# Altium project PanelDriver.PrjPcb
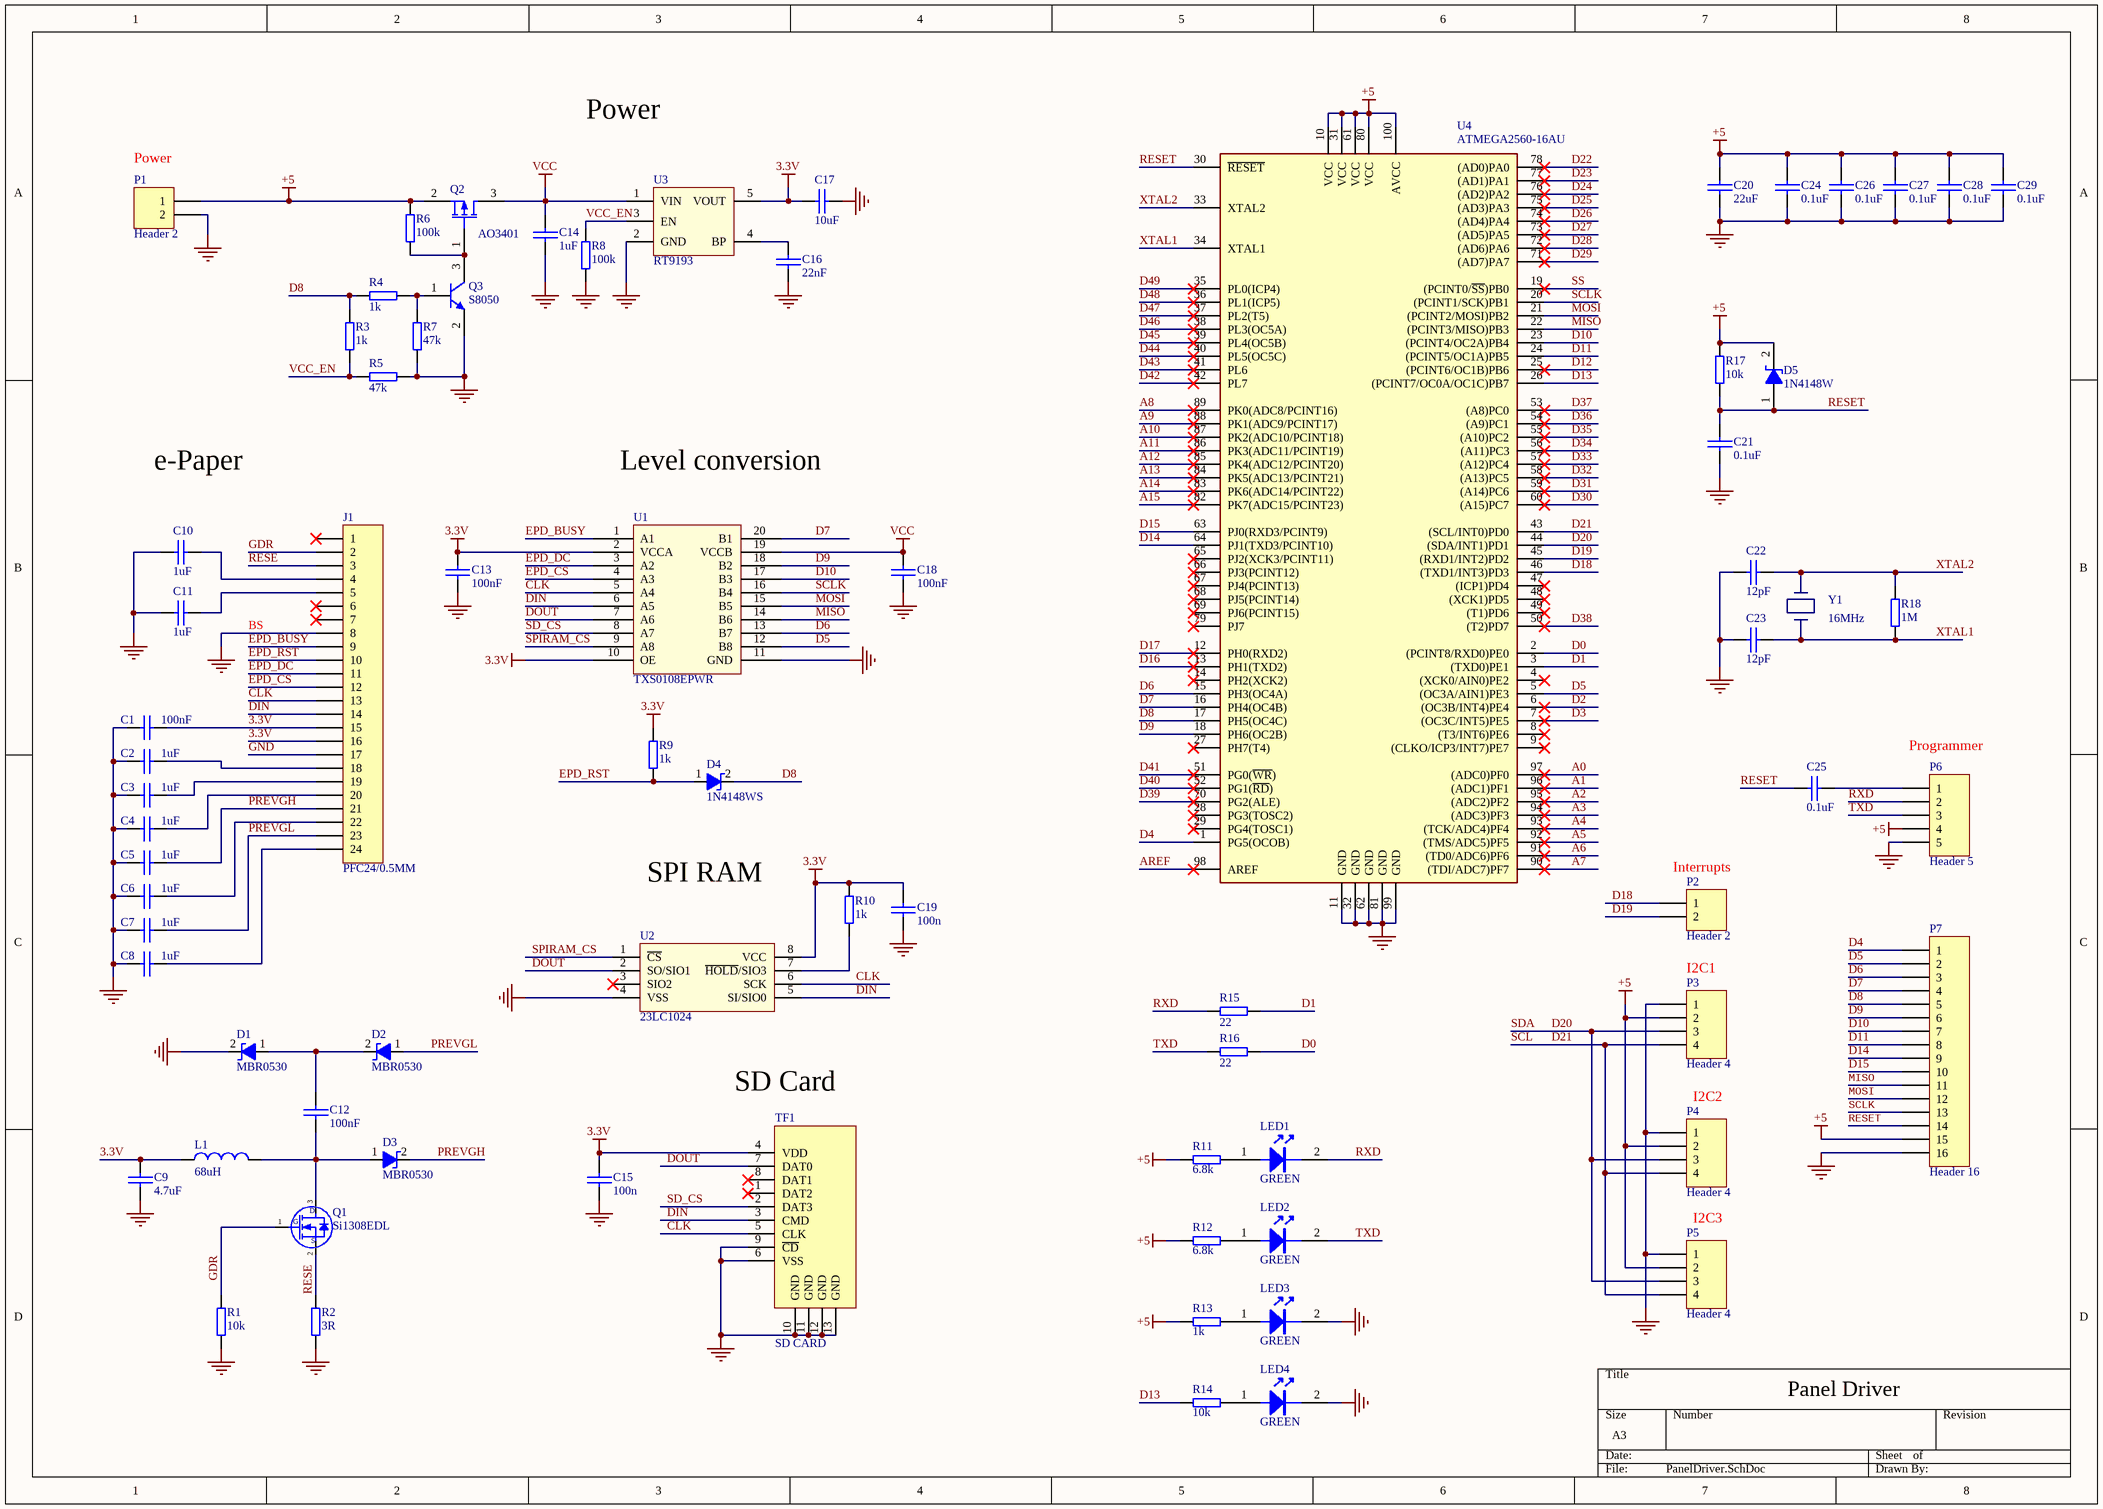
[diagram p0: PanelDriver.SchDoc]
1 sheet, 74 parts. Net scope: global (net labels, ports and power ports of the same name join across sheets).
Board file: PanelDriver.PcbDoc

## Sheet PanelDriver.SchDoc
size A3

### Parts
C1  100nF  [C0603]
C2  1uF  [C0603]
C3  1uF  [C0603]
C4  1uF  [C0603]
C5  1uF  [C0603]
C6  1uF  [C0603]
C7  1uF  [C0603]
C8  1uF  [C0603]
C9  4.7uF  [C0603]
C10  1uF  [C0603]
C11  1uF  [C0603]
C12  100nF  [C0603]
C13  100nF  [C0603]
C14  1uF  [C0603]
C15  100n  [C0603]
C16  22nF  [C0603]
C17  10uF  [C0603]
C18  100nF  [C0603]
C19  100n  [C0603]
C20  22uF  [C1206]
C21  0.1uF  [C0603]
C22  12pF  [C0603]
C23  12pF  [C0603]
C24  0.1uF  [C0603]
C25  0.1uF  [C0603]
C26  0.1uF  [C0603]
C27  0.1uF  [C0603]
C28  0.1uF  [C0603]
C29  0.1uF  [C0603]
D1  MBR0530  [SOD123]
D2  MBR0530  [SOD123]
D3  MBR0530  [SOD123]
D4  1N4148WS  [SOD-323]
D5  1N4148W  [SOD123]
J1  PFC24/0.5MM  [PFC24/0.5MM]
L1  68uH  [CD43]
LED1  GREEN  [LED-0603-GREEN]
LED2  GREEN  [LED-0603-GREEN]
LED3  GREEN  [LED-0603-GREEN]
LED4  GREEN  [LED-0603-GREEN]
P1  Header 2  [HDR1X2]
P2  Header 2  [HDR1X2]
P3  Header 4  [HDR1X4]
P4  Header 4  [HDR1X4]
P5  Header 4  [HDR1X4]
P6  Header 5  [HDR1X5]
P7  Header 16  [HDR1X16]
Q1  Si1308EDL  [SOT323-3]
Q2  AO3401  [SOT-23]
Q3  S8050  [SOT-23]
R1  10k  [R0603]
R2  3R  [R0603]
R3  1k  [R0603]
R4  1k  [R0603]
R5  47k  [R0603]
R6  100k  [R0603]
R7  47k  [R0603]
R8  100k  [R0603]
R9  1k  [R0603]
R10  1k  [R0603]
R11  6.8k  [R0603]
R12  6.8k  [R0603]
R13  1k  [R0603]
R14  10k  [R0603]
R15  22  [R0603]
R16  22  [R0603]
R17  10k  [R0603]
R18  1M  [R0603]
TF1  SD CARD  [L-KLS1-TF-003-uSD]
U1  TXS0108EPWR  [TSSOP-20_0.65mm]
U2  23LC1024  [SO8]
U3  RT9193  [SOT23-5]
U4  ATMEGA2560-16AU  [TQFP100A]
Y1  16MHz  [HC-49/US-SMD]

### Nets
3.3V: C1.1 C9.1 C13.1 C15.2 C17.2 C19.2 J1.15 J1.16 L1.1 R9.2 R10.1 TF1.4(VDD) U1.2(VCCA) U1.10(OE) U2.8(VCC) U3.5(VOUT)
+5: C20.2 C24.2 C26.2 C27.2 C28.2 C29.1 D5.2(K) P1.1 P3.2 P4.2 P5.2 P6.4 P7.15 Q2.2(S) R6.1 R11.1 R12.1 R13.1 R17.2 U4.10(VCC) U4.31(VCC) U4.61(VCC) U4.80(VCC) U4.100(AVCC)
GND: C1.2 C2.2 C3.2 C4.2 C5.2 C6.2 C7.2 C8.2 C9.2 C10.2 C11.2 C13.2 C14.1 C15.1 C16.1 C17.1 C18.2 C19.1 C20.1 C21.1 C22.2 C23.2 C24.1 C26.1 C27.1 C28.1 C29.2 D1.2(K) J1.8 J1.17 LED3.2(K) LED4.2(K) P1.2 P3.1 P4.1 P5.1 P6.5 P7.16 Q3.2(E) R1.2 R2.2 R5.1 R7.1 R8.2 TF1.6(VSS) TF1.9(~{CD}) TF1.10(GND) TF1.11(GND) TF1.12(GND) TF1.13(GND) U1.11(GND) U2.4(VSS) U3.2(GND) U4.11(GND) U4.32(GND) U4.62(GND) U4.81(GND) U4.99(GND)
VCC: C14.2 C18.1 Q2.3(D) U1.19(VCCB) U3.1(VIN)
A0: U4.97((ADC0)PF0)
A1: U4.96((ADC1)PF1)
A2: U4.95((ADC2)PF2)
A3: U4.94((ADC3)PF3)
A4: U4.93((TCK/ADC4)PF4)
A5: U4.92((TMS/ADC5)PF5)
A6: U4.91((TD0/ADC6)PF6)
A7: U4.90((TDI/ADC7)PF7)
A8: U4.89(PK0(ADC8/PCINT16))
A9: U4.88(PK1(ADC9/PCINT17))
A10: U4.87(PK2(ADC10/PCINT18))
A11: U4.86(PK3(ADC11/PCINT19))
A12: U4.85(PK4(ADC12/PCINT20))
A13: U4.84(PK5(ADC13/PCINT21))
A14: U4.83(PK6(ADC14/PCINT22))
A15: U4.82(PK7(ADC15/PCINT23))
AREF: U4.98(AREF)
CLK: J1.13 TF1.5(CLK) U1.5(A4) U2.6(SCK)
D0: R16.1 U4.2((PCINT8/RXD0)PE0)
D1: R15.1 U4.3((TXD0)PE1)
D2: U4.6((OC3B/INT4)PE4)
D3: U4.7((OC3C/INT5)PE5)
D4: P7.1 U4.1(PG5(OCOB))
D5: P7.2 U1.12(B8) U4.5((OC3A/AIN1)PE3)
D6: P7.3 U1.13(B7) U4.15(PH3(OC4A))
D7: P7.4 U1.20(B1) U4.16(PH4(OC4B))
D8: D4.2(K) P7.5 R3.2 R4.1 U4.17(PH5(OC4C))
D9: P7.6 U1.18(B2) U4.18(PH6(OC2B))
D10: P7.7 U1.17(B3) U4.23((PCINT4/OC2A)PB4)
D11: P7.8 U4.24((PCINT5/OC1A)PB5)
D12: U4.25((PCINT6/OC1B)PB6)
D13: R14.1 U4.26((PCINT7/OC0A/OC1C)PB7)
D14: P7.9 U4.64(PJ1(TXD3/PCINT10))
D15: P7.10 U4.63(PJ0(RXD3/PCINT9))
D16: U4.13(PH1(TXD2))
D17: U4.12(PH0(RXD2))
D18: P2.1 U4.46((TXD1/INT3)PD3)
D19: P2.2 U4.45((RXD1/INT2)PD2)
D20: P3.3 P4.3 P5.3 U4.44((SDA/INT1)PD1)  [also labelled SDA]
D21: P3.4 P4.4 P5.4 U4.43((SCL/INT0)PD0)  [also labelled SCL]
D22: U4.78((AD0)PA0)
D23: U4.77((AD1)PA1)
D24: U4.76((AD2)PA2)
D25: U4.75((AD3)PA3)
D26: U4.74((AD4)PA4)
D27: U4.73((AD5)PA5)
D28: U4.72((AD6)PA6)
D29: U4.71((AD7)PA7)
D30: U4.60((A15)PC7)
D31: U4.59((A14)PC6)
D32: U4.58((A13)PC5)
D33: U4.57((A12)PC4)
D34: U4.56((A11)PC3)
D35: U4.55((A10)PC2)
D36: U4.54((A9)PC1)
D37: U4.53((A8)PC0)
D38: U4.50((T2)PD7)
D39: U4.70(PG2(ALE))
D40: U4.52(PG1(~{RD}))
D41: U4.51(PG0(~{WR}))
D42: U4.42(PL7)
D43: U4.41(PL6)
D44: U4.40(PL5(OC5C))
D45: U4.39(PL4(OC5B))
D46: U4.38(PL3(OC5A))
D47: U4.37(PL2(T5))
D48: U4.36(PL1(ICP5))
D49: U4.35(PL0(ICP4))
DIN: J1.14 TF1.3(CMD) U1.6(A5) U2.5(SI/SIO0)
DOUT: TF1.7(DAT0) U1.7(A6) U2.2(SO/SIO1)
EPD_BUSY: J1.9 U1.1(A1)
EPD_CS: J1.12 U1.4(A3)
EPD_DC: J1.11 U1.3(A2)
EPD_RST: D4.1(A) J1.10 R9.1
GDR: J1.2 Q1.1(G) R1.1
MISO: P7.11 U1.14(B6) U4.22((PCINT3/MISO)PB3)
MOSI: P7.12 U1.15(B5) U4.21((PCINT2/MOSI)PB2)
PREVGH: C5.1 D3.2(K) J1.21
PREVGL: C7.1 D2.1(A) J1.23
RESE: J1.3 Q1.2(S) R2.1
RESET: C21.2 C25.2 D5.1(A) P7.14 R17.1 U4.30(~{RESET})
RXD: LED1.2(K) P6.2 R15.2
SCLK: P7.13 U1.16(B4) U4.20((PCINT1/SCK)PB1)
SD_CS: TF1.2(DAT3) U1.8(A7)
SPIRAM_CS: U1.9(A8) U2.1(~{CS})
SS: U4.19((PCINT0/~{SS})PB0)
TXD: LED2.2(K) P6.3 R16.2
VCC_EN: R3.1 R5.2 R8.1 U3.3(EN)
XTAL1: C23.1 R18.2 U4.34(XTAL1) Y1.2
XTAL2: C22.1 R18.1 U4.33(XTAL2) Y1.1
NetC2_1: C2.1 J1.18
NetC3_1: C3.1 J1.19
NetC4_1: C4.1 J1.20
NetC6_1: C6.1 J1.22
NetC8_1: C8.1 J1.24
NetC10_1: C10.1 J1.4
NetC11_1: C11.1 J1.5
NetC12_1: C12.1 D1.1(A) D2.2(K)
NetC12_2: C12.2 D3.1(A) L1.2 Q1.3(D)
NetC16_2: C16.2 U3.4(BP)
NetC25_1: C25.1 P6.1
NetLED1_1: LED1.1(A) R11.2
NetLED2_1: LED2.1(A) R12.2
NetLED3_1: LED3.1(A) R13.2
NetLED4_1: LED4.1(A) R14.2
NetQ2_1: Q2.1(G) Q3.3(C) R6.2
NetQ3_1: Q3.1(B) R4.2 R7.2
NetR10_2: R10.2 U2.7(~{HOLD}/SIO3)

Not connected (* = marked no-connect by the designer): J1 1* 6* 7*; TF1 1(DAT2)* 8(DAT1)*; U2 3(SIO2)*; U4 4((XCK0/AIN0)PE2)* 8((T3/INT6)PE6)* 9((CLKO/ICP3/INT7)PE7)* 14(PH2(XCK2))* 27(PH7(T4))* 28(PG3(TOSC2))* 29(PG4(TOSC1))* 47((ICP1)PD4)* 48((XCK1)PD5)* 49((T1)PD6)* 65(PJ2(XCK3/PCINT11))* 66(PJ3(PCINT12))* 67(PJ4(PCINT13))* 68(PJ5(PCINT14))* 69(PJ6(PCINT15))* 79(PJ7)*

### Notes on the sheet
- (near P1) Power
- Power
- e-Paper
- Level conversion
- BS
- (near P6) Programmer
- SPI RAM
- (near P2) Interrupts
- I2C1
- SD Card
- I2C2
- I2C3
- Panel Driver

### Library data of the parts
C1-C15 C18 C19 = C: Capacitor; Manufacturer: Any; Manufacturer Part Number: Any
C16 C17 = C_100uF_6.3V_1206: Capacitor; Manufacturer: Any; Voltage: 6.3V; Parameter 1: 85; Manufacturer Part Number: Any; Chip-Dip Link: https://www.chipdip.ru/product0/8015829745
C20 = C: 16V 22uF X7R ±10% 1206  Multilayer Ceramic Capacitors MLCC - SMD/SMT ROHS; Manufacturer: Any; Manufacturer Part Number: Any
C21 C24-C29 = C: 25V 100nF X7R ±10% 0603  Multilayer Ceramic Capacitors MLCC - SMD/SMT ROHS; Manufacturer: Any; Manufacturer Part Number: Any
  C28: JLCPCB Part Number: C307361; JLCPCB Price: 0.02
C22 C23 = C_100uF_6.3V_1206: 50V 22pF X7R ±10% 0603  Multilayer Ceramic Capacitors MLCC - SMD/SMT ROHS; Manufacturer: Any; Voltage: 6.3V; Parameter 1: 85; Manufacturer Part Number: Any; Chip-Dip Link: https://www.chipdip.ru/product0/8015829745
D1-D4 = SS14F: Manufacture: UMF; Manufacturer: Any; Chip-Dip Link: https://www.chipdip.ru/product/ss14f; Price: 4
  D1-D3: Manufacturer Part Number: MBR0530
  D4: Manufacturer Part Number: 1N4148WS
D5 = SS14F: 1N4148W-E3-08, Rectifier Diode Small Signal Switching Si 100V 0.15A 4ns 2-Pin SOD-123 T/R; Manufacture: Any; Price: 4; Manufacturer: Any; Manufacturer Part Number: Any
J1 = PFC24/0.5MMHeader 24: 24 Position FFC, FPC Connector Contacts, Bottom 0.020" (0.50mm) Surface Mount, Right Angle; Manufacturer: MOLEX; Manufacturer Part Number: 0524372471; LatestRevisionDate: 17-Jul-2002; LatestRevisionNote: Re-released for DXP Platform.; Publisher: Altium Limited
L1 = IND: SMD, 4x4mm  Inductor; Manufacturer: Any; Manufacturer Part Number: Any; Chip-Dip Link: https://www.chipdip.ru/product/lqh55dn470m; Price: 110
LED1-LED4 = LED: 0603  Light Emitting Diodes (LED) ROHS; Manufacturer: Any; Manufacturer Part Number: Any; JLCPCB Part Number: C965812; JLCPCB Price: 0.005
P1 P2 = Header 2: Header, 2-Pin; LatestRevisionDate: 17-Jul-2002; LatestRevisionNote: Re-released for DXP Platform.; Publisher: Altium Limited
P3-P5 = Header 4: Header, 4-Pin; LatestRevisionDate: 17-Jul-2002; LatestRevisionNote: Re-released for DXP Platform.; Publisher: Altium Limited
P6 = Header 5: Header, 5-Pin; Manufacturer: Any; LatestRevisionDate: 17-Jul-2002; LatestRevisionNote: Re-released for DXP Platform.; Publisher: Altium Limited; Manufacturer Part Number: Any
P7 = Header 16: Header, 16-Pin; LatestRevisionDate: 17-Jul-2002; LatestRevisionNote: Re-released for DXP Platform.; Publisher: Altium Limited
Q1 = Si1308EDL: Manufacturer: Any; PartNumber: Si1308EDL; Manufacturer Part Number: Si1308EDL
Q2 = ZXMP6A13FTA: Manufacturer: Any; FET Type: MOSFET P-Channel, Metal Oxide; FET Feature: Standard; Drain to Source Voltage (Vdss): 60V; Current - Continuous Drain (Id) @ 25°C: 900mA (Ta); Rds On (Max) @ Id, Vgs: 400 mOhm @ 900mA, 10V; Vgs(th) (Max) @ Id: 1V @ 250µA; Gate Charge (Qg) @ Vgs: 5.9nC @ 10V; Input Capacitance (Ciss) @ Vds: 219pF @ 30V; Power - Max: 625mW; Supplier 1: Digi-Key; Manufacturer Part Number: AO3401; RoHS: RoHS Compliant; Category: Discrete Semiconductor Products; Stock 1: 70275; Pricing 1: 1=0.54, 10=0.464, 100=0.3468, 500=0.2724, 1000=0.21 (USD); Packaging: Cut Tape (CT); Mounting Type: Surface Mount; Package / Case: TO-236-3, SC-59, SOT-23-3; Supplier Device Package: SOT-23-3; ComponentLink1URL: http://www.diodes.com/_files/datasheets/ZXMP6A13F.pdf; ComponentLink1Description: http://www.diodes.com/_files/datasheets/ZXMP6A13F.pdf; Supplier Part Number 1: ZXMP6A13FCT-ND
Q3 = NPN_BJT: Manufacturer: Any; Manufacturer Part Number: S8050
R1-R10 = R: Resistor; Manufacturer: Any; Manufacturer Part Number: Any
R11 R12 = R: 125mW Thick Film Resistors ±100ppm/℃ ±5% 6.8kΩ 0603  Chip Resistor - Surface Mount ROHS; Manufacturer: Any; Manufacturer Part Number: Any; JLCPCB Part Number: C100046; JLCPCB Price: 0.002
R13 = R: 125mW Thick Film Resistors ±100ppm/℃ ±5% 1kΩ 0603  Chip Resistor - Surface Mount ROHS; Manufacturer: Any; Manufacturer Part Number: Any; JLCPCB Part Number: C100046; JLCPCB Price: 0.002
R14 R17 = R: 125mW Thick Film Resistors ±100ppm/℃ ±5% 10kΩ 0603  Chip Resistor - Surface Mount ROHS; Manufacturer: Any; Manufacturer Part Number: Any
  R14: JLCPCB Part Number: C100046; JLCPCB Price: 0.002
R15 R16 = R: 125mW Thick Film Resistors ±100ppm/℃ ±5% 22Ω 0603  Chip Resistor - Surface Mount ROHS; Manufacturer: Any; Manufacturer Part Number: Any
R18 = R: 125mW Thick Film Resistors ±100ppm/℃ ±5% 1M 0603  Chip Resistor - Surface Mount ROHS; Manufacturer: Any; Manufacturer Part Number: Any
TF1 = SD CARD: SDCARD; PartNumber: 693071010811; Manufacturer: KLS electronic co ltd; Supplier 1: Digi-Key; Supplier Part Number 1: 732-3819-2-ND; Price: 3,3; Manufacturer Part Number: L-KLS1-TF-003-uSD
U1 = TXS0108EPWR: Manufacturer: Any; Manufacturer Part Number: TXS0108EPWR; Chip-Dip Link: https://www.platan.ru/cgi-bin/qwery.pl/id=944671602; Price: 290
U2 = 23LC1024: Manufacturer: Any; Manufacturer Part Number: 23LC1024; Chip-Dip Link: https://www.chipdip.ru/product/max485esa-umw; Price: 46
U3 = RT9193: Manufacturer: Any; Manufacturer Part Number: RT9193; Chip-Dip Link: https://www.chipdip.ru/product/xl1509e-5.0; Price: 34
U4 = ATMEGA2560-16AU: 256KB 4.5V~5.5V AVR 8KB 16MHz FLASH 86 TQFP-100(14x14)  Microcontroller Units (MCUs/MPUs/SOCs) ROHS; Manufacturer: Microchip Tech; Manufacturer Part Number: ATMEGA2560-16AU
Y1 = Crystal-16MHz: Crystal 16MHz 12pF SMD; Manufacturer: Any; Footprint: OLIMEX_Crystal-FP:HCX-4S_2Pins_5.0x3.2mm; Manufacturer Part Number: Any